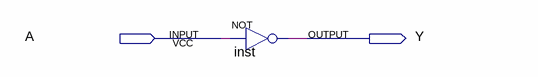
[diagram p0: schematic sheet]
// Quartus schematic NotGate_scheme.bdf as structural Verilog: 1 symbols, 2 pins
module NotGate_scheme (
  input  A,
  output Y
);

  not inst (Y, A);
endmodule
